# EAGLE design shield (EAGLE 8.0.0)
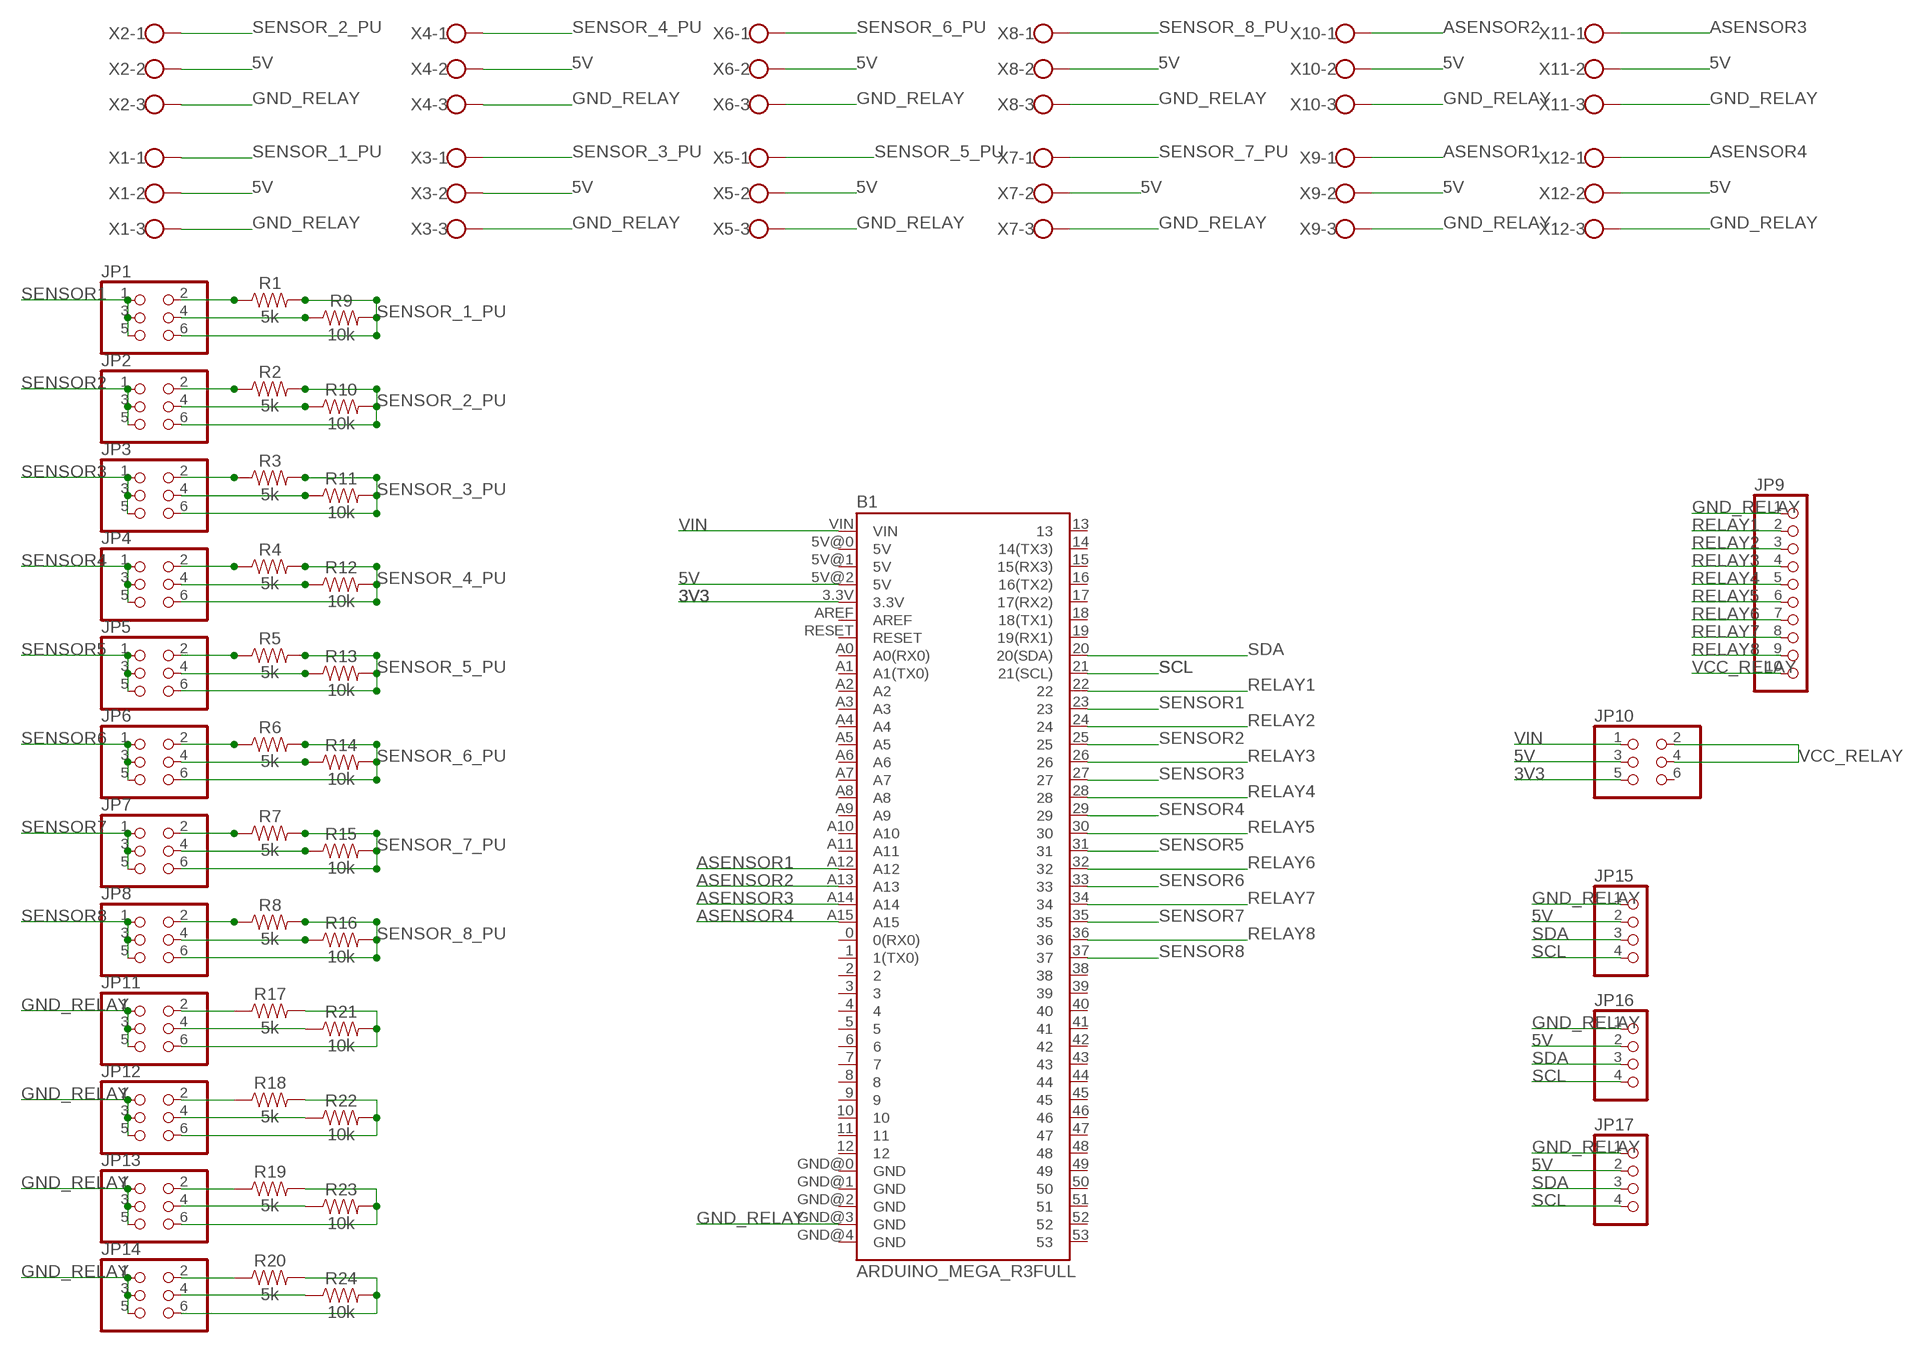
[diagram p0: schematic, sheet 1]

## Parts
B1  ARDUINO_MEGA_R3FULL  [ARDUINO_MEGA]
JP1  PINHD-2X3  [2X03]
JP2  PINHD-2X3  [2X03]
JP3  PINHD-2X3  [2X03]
JP4  PINHD-2X3  [2X03]
JP5  PINHD-2X3  [2X03]
JP6  PINHD-2X3  [2X03]
JP7  PINHD-2X3  [2X03]
JP8  PINHD-2X3  [2X03]
JP9  PINHD-1X10  [1X10]
JP10  PINHD-2X3  [2X03]
JP11  PINHD-2X3  [2X03]
JP12  PINHD-2X3  [2X03]
JP13  PINHD-2X3  [2X03]
JP14  PINHD-2X3  [2X03]
JP15  PINHD-1X4  [1X04]
JP16  PINHD-1X4  [1X04]
JP17  PINHD-1X4  [1X04]
R1  5k  10KOHM-HORIZ-1/4W-1%  [AXIAL-0.3]
R2  5k  10KOHM-HORIZ-1/4W-1%  [AXIAL-0.3]
R3  5k  10KOHM-HORIZ-1/4W-1%  [AXIAL-0.3]
R4  5k  10KOHM-HORIZ-1/4W-1%  [AXIAL-0.3]
R5  5k  10KOHM-HORIZ-1/4W-1%  [AXIAL-0.3]
R6  5k  10KOHM-HORIZ-1/4W-1%  [AXIAL-0.3]
R7  5k  10KOHM-HORIZ-1/4W-1%  [AXIAL-0.3]
R8  5k  10KOHM-HORIZ-1/4W-1%  [AXIAL-0.3]
R9  10k  10KOHM-HORIZ-1/4W-1%  [AXIAL-0.3]
R10  10k  10KOHM-HORIZ-1/4W-1%  [AXIAL-0.3]
R11  10k  10KOHM-HORIZ-1/4W-1%  [AXIAL-0.3]
R12  10k  10KOHM-HORIZ-1/4W-1%  [AXIAL-0.3]
R13  10k  10KOHM-HORIZ-1/4W-1%  [AXIAL-0.3]
R14  10k  10KOHM-HORIZ-1/4W-1%  [AXIAL-0.3]
R15  10k  10KOHM-HORIZ-1/4W-1%  [AXIAL-0.3]
R16  10k  10KOHM-HORIZ-1/4W-1%  [AXIAL-0.3]
R17  5k  10KOHM-HORIZ-1/4W-1%  [AXIAL-0.3]
R18  5k  10KOHM-HORIZ-1/4W-1%  [AXIAL-0.3]
R19  5k  10KOHM-HORIZ-1/4W-1%  [AXIAL-0.3]
R20  5k  10KOHM-HORIZ-1/4W-1%  [AXIAL-0.3]
R21  10k  10KOHM-HORIZ-1/4W-1%  [AXIAL-0.3]
R22  10k  10KOHM-HORIZ-1/4W-1%  [AXIAL-0.3]
R23  10k  10KOHM-HORIZ-1/4W-1%  [AXIAL-0.3]
R24  10k  10KOHM-HORIZ-1/4W-1%  [AXIAL-0.3]
X1  W237-103  [W237-103]
X2  W237-103  [W237-103]
X3  W237-103  [W237-103]
X4  W237-103  [W237-103]
X5  W237-103  [W237-103]
X6  W237-103  [W237-103]
X7  W237-103  [W237-103]
X8  W237-103  [W237-103]
X9  W237-103  [W237-103]
X10  W237-103  [W237-103]
X11  W237-103  [W237-103]
X12  W237-103  [W237-103]

## Nets
3V3: B1.3.3V JP10.5
5V: B1.5V@2(5V) JP10.3 JP15.2 JP16.2 JP17.2 X1.2 X2.2 X3.2 X4.2 X5.2 X6.2 X7.2 X8.2 X9.2 X10.2 X11.2 X12.2
ASENSOR1: B1.A12 X9.1
ASENSOR2: B1.A13 X10.1
ASENSOR3: B1.A14 X11.1
ASENSOR4: B1.A15 X12.1
GND_RELAY: B1.GND@3(GND) JP9.1 JP11.1 JP11.3 JP11.5 JP12.1 JP12.3 JP12.5 JP13.1 JP13.3 JP13.5 JP14.1 JP14.3 JP14.5 JP15.1 JP16.1 JP17.1 X1.3 X2.3 X3.3 X4.3 X5.3 X6.3 X7.3 X8.3 X9.3 X10.3 X11.3 X12.3
N$1: JP2.4 R10.P$1
N$4: JP1.4 R9.P$1
N$7: JP3.4 R11.P$1
N$9: JP4.4 R12.P$1
N$10: JP14.2 R20.P$1
N$11: JP5.4 R13.P$1
N$12: JP14.6 R20.P$2 R24.P$2
N$13: JP6.4 R14.P$1
N$14: JP14.4 R24.P$1
N$15: JP7.4 R15.P$1
N$16: JP13.2 R19.P$1
N$17: JP8.4 R16.P$1
N$18: JP13.6 R19.P$2 R23.P$2
N$19: JP13.4 R23.P$1
N$20: JP12.2 R18.P$1
N$21: JP1.2 R1.P$1
N$22: JP2.2 R2.P$1
N$23: JP3.2 R3.P$1
N$24: JP4.2 R4.P$1
N$25: JP5.2 R5.P$1
N$26: JP6.2 R6.P$1
N$27: JP7.2 R7.P$1
N$28: JP8.2 R8.P$1
N$29: JP12.6 R18.P$2 R22.P$2
N$30: JP12.4 R22.P$1
N$31: JP11.2 R17.P$1
N$32: JP11.6 R17.P$2 R21.P$2
N$33: JP11.4 R21.P$1
RELAY1: B1.22 JP9.2
RELAY2: B1.24 JP9.3
RELAY3: B1.26 JP9.4
RELAY4: B1.28 JP9.5
RELAY5: B1.30 JP9.6
RELAY6: B1.32 JP9.7
RELAY7: B1.34 JP9.8
RELAY8: B1.36 JP9.9
SCL: B1.21(21(SCL)) JP15.4 JP16.4 JP17.4
SDA: B1.20(20(SDA)) JP15.3 JP16.3 JP17.3
SENSOR1: B1.23 JP1.1 JP1.3 JP1.5
SENSOR2: B1.25 JP2.1 JP2.3 JP2.5
SENSOR3: B1.27 JP3.1 JP3.3 JP3.5
SENSOR4: B1.29 JP4.1 JP4.3 JP4.5
SENSOR5: B1.31 JP5.1 JP5.3 JP5.5
SENSOR6: B1.33 JP6.1 JP6.3 JP6.5
SENSOR7: B1.35 JP7.1 JP7.3 JP7.5
SENSOR8: B1.37 JP8.1 JP8.3 JP8.5
SENSOR_1_PU: JP1.6 R1.P$2 R9.P$2 X1.1
SENSOR_2_PU: JP2.6 R2.P$2 R10.P$2 X2.1
SENSOR_3_PU: JP3.6 R3.P$2 R11.P$2 X3.1
SENSOR_4_PU: JP4.6 R4.P$2 R12.P$2 X4.1
SENSOR_5_PU: JP5.6 R5.P$2 R13.P$2 X5.1
SENSOR_6_PU: JP6.6 R6.P$2 R14.P$2 X6.1
SENSOR_7_PU: JP7.6 R7.P$2 R15.P$2 X7.1
SENSOR_8_PU: JP8.6 R8.P$2 R16.P$2 X8.1
VCC_RELAY: JP9.10 JP10.2 JP10.4
VIN: B1.VIN JP10.1
Unconnected: B1.0(0(RX0)) B1.1(1(TX0)) B1.2 B1.3 B1.4 B1.5 B1.5V@0(5V) B1.5V@1(5V) B1.6 B1.7 B1.8 B1.9 B1.10 B1.11 B1.12 B1.13 B1.14(14(TX3)) B1.15(15(RX3)) B1.16(16(TX2)) B1.17(17(RX2)) B1.18(18(TX1)) B1.19(19(RX1)) B1.38 B1.39 B1.40 B1.41 B1.42 B1.43 B1.44 B1.45 B1.46 B1.47 B1.48 B1.49 B1.50 B1.51 B1.52 B1.53 B1.A0(A0(RX0)) B1.A1(A1(TX0)) B1.A2 B1.A3 B1.A4 B1.A5 B1.A6 B1.A7 B1.A8 B1.A9 B1.A10 B1.A11 B1.AREF B1.GND@0(GND) B1.GND@1(GND) B1.GND@2(GND) B1.GND@4(GND) B1.RESET JP10.6

## Library data of the parts
B1 = SparkFun-Boards:ARDUINO_MEGA_R3: Arduino Mega R3 ATmega2560 R3 compatible footprint. SparkFun Products: Arduino Mega 2560 R3 <https://www.sparkfun.com/products/11061>
JP1-JP8 JP10-JP14 = pinhead:PINHD-2X3: PIN HEADER
JP9 = pinhead:PINHD-1X10: PIN HEADER
JP15-JP17 = pinhead:PINHD-1X4: PIN HEADER
R1-R8 R17-R20 = SparkFun-Resistors:10KOHM: 10kΩ resistor A resistor is a passive two-terminal electrical component that implements electrical resistance as a circuit element. Resistors act to reduce current flow, and, at the same time, act to lower voltage levels within circuits. - Wikipedia; PROD_ID: RES-12183; VALUE: 10k
R9-R16 R21-R24 = SparkFun-Resistors:10KOHM: 10kΩ resistor A resistor is a passive two-terminal electrical component that implements electrical resistance as a circuit element. Resistors act to reduce current flow, and, at the same time, act to lower voltage levels within circuits. - Wikipedia; PROD_ID: RES-12183
X1-X12 = con-wago-500:W237-103: WAGO SCREW CLAMP; MPN: 237-103; OC_FARNELL: unknown; OC_NEWARK: 18M7116

## Board
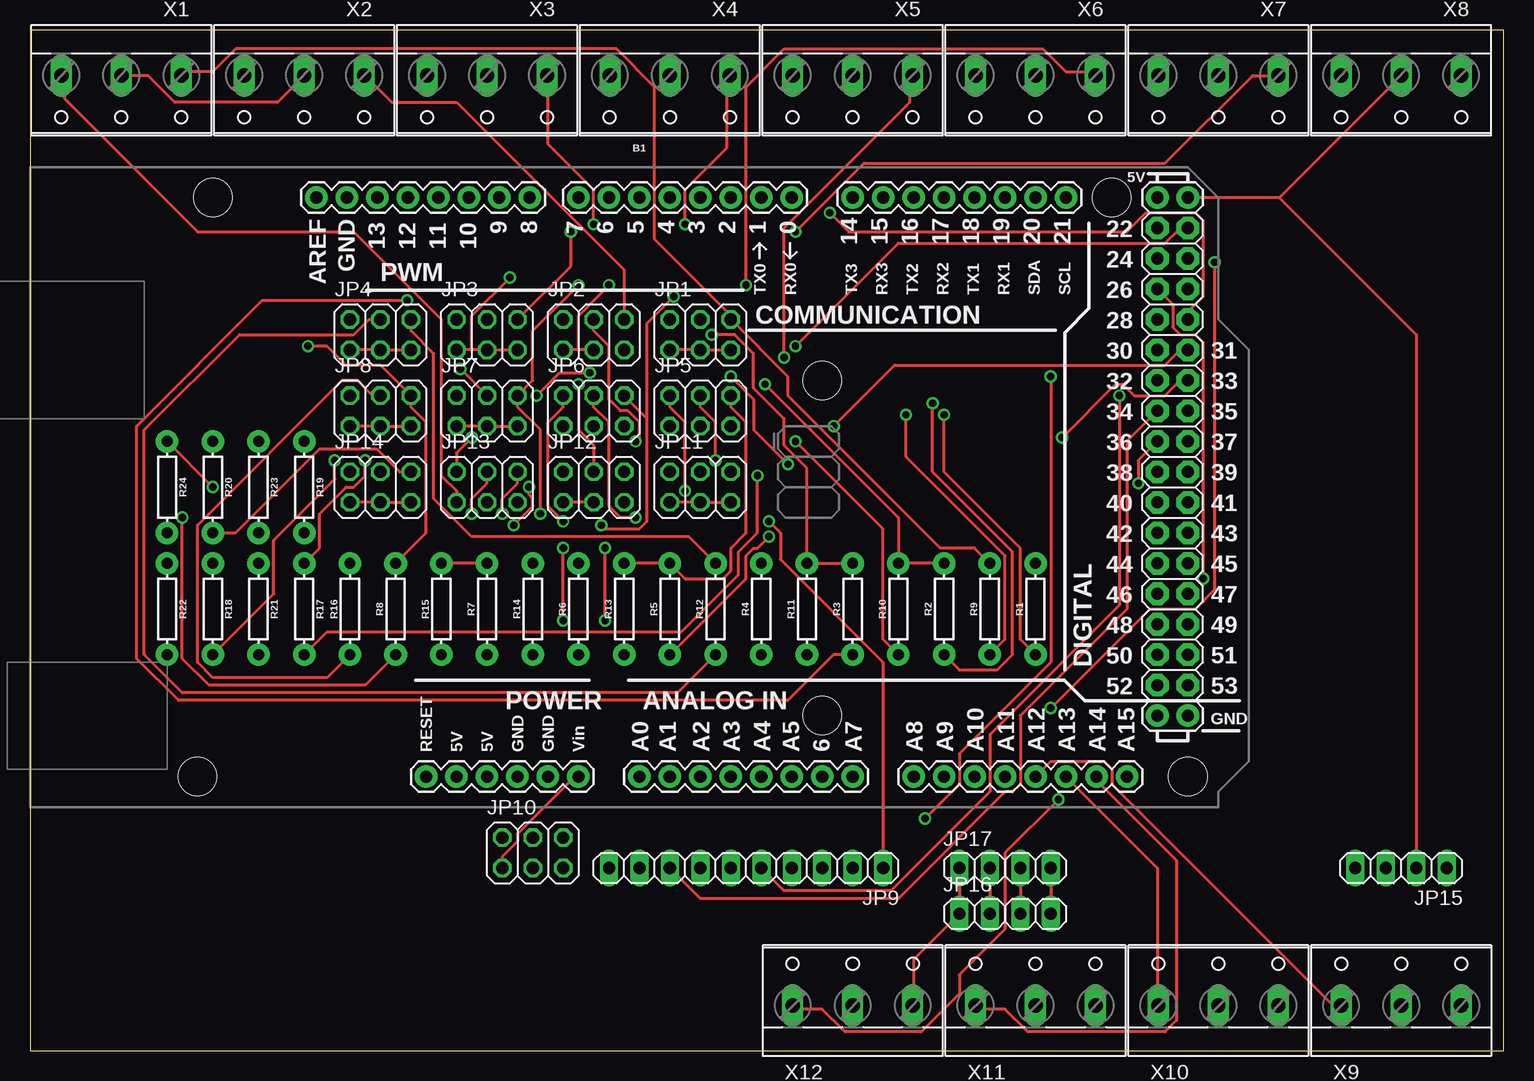
[diagram p1: board, top side]
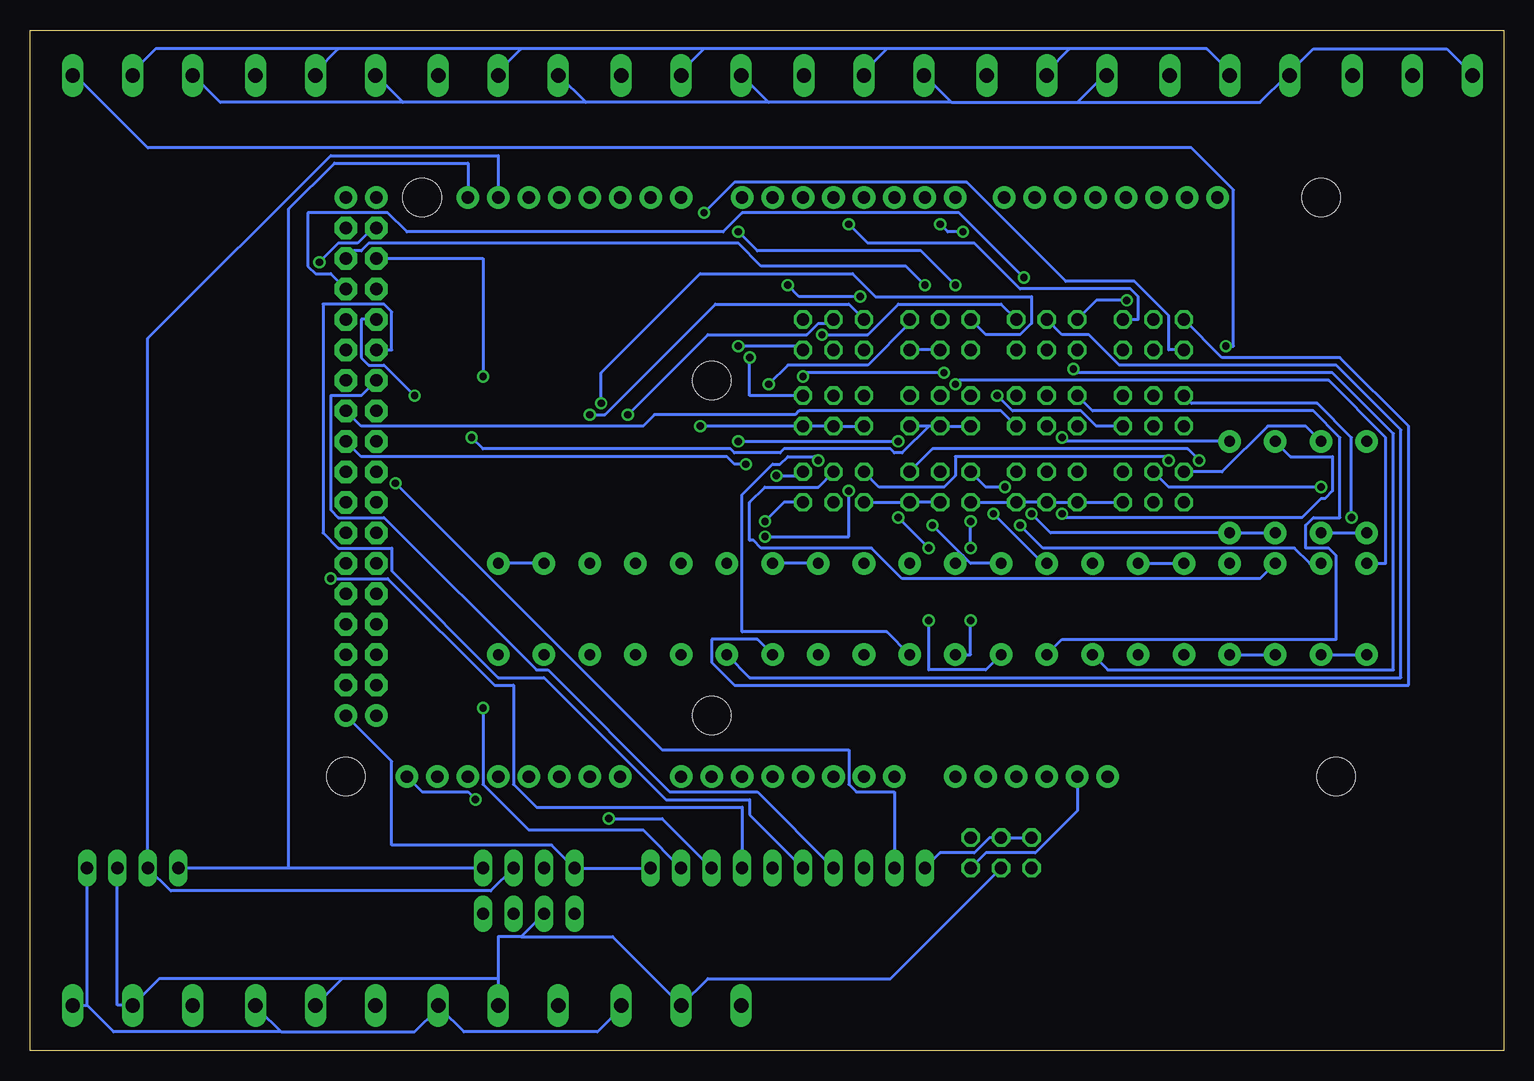
[diagram p2: board, bottom side, seen from below]

Size 122.86 x 85.08 mm. Coordinates in mm from the lower left corner, seen from the top.
Outline: 0,0 122.86,0 122.86,85.08 0,85.08 0,0
Copper layers (1*16): Top 0.035mm / dielectric 1.5mm / Bottom 0.035mm
Design rules "default": minimum track width 10mil, minimum drill 24mil, track to track 8mil, track to pad 8mil, pad to pad 8mil, via to via 8mil, smd to smd 8mil, copper to edge 40mil, drill to drill 8mil, minimum pad ring 10mil, minimum via ring 8mil, stop-mask expansion 4mil, vias tented up to drill 0mil, thermal gap 10mil

### Footprints (pad centres in the part's own frame; a part is rotated, then mirrored left to right if it is on the bottom)
ARDUINO_MEGA = drill 1.016 pad 1.88: 0 13.97,24.13; 1 11.43,24.13; 2 8.89,24.13; 3 6.35,24.13; 3.3V -13.97,-24.13; 4 3.81,24.13; 5 1.27,24.13; 5V@0 -11.43,-24.13; 5V@1 44.45,24.13; 5V@2 46.99,24.13; 6 -1.27,24.13; 7 -3.81,24.13; 8 -7.874,24.13; 9 -10.414,24.13; 10 -12.954,24.13; 11 -15.494,24.13; 12 -18.034,24.13; 13 -20.574,24.13; 14 19.05,24.13; 15 21.59,24.13; 16 24.13,24.13; 17 26.67,24.13; 18 29.21,24.13; 19 31.75,24.13; 20 34.29,24.13; 21 36.83,24.13; A0 1.27,-24.13; A1 3.81,-24.13; A2 6.35,-24.13; A3 8.89,-24.13; A4 11.43,-24.13; A5 13.97,-24.13; A6 16.51,-24.13; A7 19.05,-24.13; A8 24.13,-24.13; A9 26.67,-24.13; A10 29.21,-24.13; A11 31.75,-24.13; A12 34.29,-24.13; A13 36.83,-24.13; A14 39.37,-24.13; A15 41.91,-24.13; AREF -25.654,24.13; GND@0 -8.89,-24.13; GND@1 -6.35,-24.13; GND@2 44.45,-19.05; GND@3 46.99,-19.05; GND@4 -23.114,24.13; RESET -16.51,-24.13; VIN -3.81,-24.13 | drill 1.016 pad 1.88 octagon: 22 44.45,21.59; 23 46.99,21.59; 24 44.45,19.05; 25 46.99,19.05; 26 44.45,16.51; 27 46.99,16.51; 28 44.45,13.97; 29 46.99,13.97; 30 44.45,11.43; 31 46.99,11.43; 32 44.45,8.89; 33 46.99,8.89; 34 44.45,6.35; 35 46.99,6.35; 36 44.45,3.81; 37 46.99,3.81; 38 44.45,1.27; 39 46.99,1.27; 40 44.45,-1.27; 41 46.99,-1.27; 42 44.45,-3.81; 43 46.99,-3.81; 44 44.45,-6.35; 45 46.99,-6.35; 46 44.45,-8.89; 47 46.99,-8.89; 48 44.45,-11.43; 49 46.99,-11.43; 50 44.45,-13.97; 51 46.99,-13.97; 52 44.45,-16.51; 53 46.99,-16.51 | hole 3.2: -34.29,24.13; -35.56,-24.13; 16.51,8.89; 16.51,-19.05; 40.64,24.13; 46.99,-24.13
2X03 = drill 1.016 octagon: 1 -2.54,-1.27; 2 -2.54,1.27; 3 0,-1.27; 4 0,1.27; 5 2.54,-1.27; 6 2.54,1.27
1X10 = drill 1.016 long: 1 -11.43,0; 2 -8.89,0; 3 -6.35,0; 4 -3.81,0; 5 -1.27,0; 6 1.27,0; 7 3.81,0; 8 6.35,0; 9 8.89,0; 10 11.43,0
1X04 = drill 1.016 long: 1 -3.81,0; 2 -1.27,0; 3 1.27,0; 4 3.81,0
AXIAL-0.3 = drill 0.9 pad 1.88: P$1 -3.81,0; P$2 3.81,0
W237-103 = drill 1.194 long: 1 -5,-1.29; 2 0,-1.29; 3 5,-1.29

### Placement (x,y rotation side)
B1  49.53,46.99 0 top
JP1  55.88,59.69 0 top
JP2  46.99,59.69 0 top
JP3  38.1,59.69 0 top
JP4  29.21,59.69 0 top
JP5  55.88,53.34 0 top
JP6  46.99,53.34 0 top
JP7  38.1,53.34 0 top
JP8  29.21,53.34 0 top
JP9  59.69,15.24 180 top
JP10  41.91,16.51 0 top
JP11  55.88,46.99 0 top
JP12  46.99,46.99 0 top
JP13  38.1,46.99 0 top
JP14  29.21,46.99 0 top
JP15  114.3,15.24 180 top
JP16  81.28,11.43 0 top
JP17  81.28,15.24 0 top
R1  83.82,36.83 90 top
R2  76.2,36.83 90 top
R3  68.58,36.83 90 top
R4  60.96,36.83 90 top
R5  53.34,36.83 90 top
R6  45.72,36.83 90 top
R7  38.1,36.83 90 top
R8  30.48,36.83 90 top
R9  80.01,36.83 90 top
R10  72.39,36.83 90 top
R11  64.77,36.83 90 top
R12  57.15,36.83 90 top
R13  49.53,36.83 90 top
R14  41.91,36.83 90 top
R15  34.29,36.83 90 top
R16  26.67,36.83 90 top
R17  22.86,36.83 270 top
R18  15.24,36.83 270 top
R19  22.86,46.99 270 top
R20  15.24,46.99 270 top
R21  19.05,36.83 270 top
R22  11.43,36.83 270 top
R23  19.05,46.99 270 top
R24  11.43,46.99 270 top
X1  7.62,80.01 180 top
X2  22.86,80.01 180 top
X3  38.1,80.01 180 top
X4  53.34,80.01 180 top
X5  68.58,80.01 180 top
X6  83.82,80.01 180 top
X7  99.06,80.01 180 top
X8  114.3,80.01 180 top
X9  114.3,5.08 0 top
X10  99.06,5.08 0 top
X11  83.82,5.08 0 top
X12  68.58,5.08 0 top

### Tracks (layer width: path | path; a pad name or v marks a point on that pad's centre or on a via)
3V3
  Bottom 0.254: JP10.5 43.18,16.51 39.05,16.51 35.56,20 B1.3.3V
5V
  Top 0.254: JP17.2 JP16.2 | X1.2 7.62,81.28 9.84,81.28 12.07,79.06 20.64,79.06 22.86,81.28 X2.2 | 104.14,71.12 B1.5V@2 | 104.14,71.12 114.3,81.28 X8.2 | JP15.2 115.57,59.69 104.14,71.12
  Bottom 0.254: JP10.3 51.12,6.03 66.36,6.03 68.58,3.81 | JP15.2 115.57,3.81 114.3,3.81 | 83.82,6.03 83.82,9.53 81.92,9.53 | 83.82,6.03 X11.2 | JP16.2 81.92,9.53 | 96.84,6.03 99.06,3.81 X10.2 | 83.82,6.03 96.84,6.03 | 114.3,3.81 112.08,6.03 96.84,6.03 | 114.3,3.81 X9.2 | 68.58,3.81 74.3,9.53 81.92,9.53 | 68.58,3.81 X12.2 | 36.2,83.5 38.1,81.6 X3.2 | 36.2,83.5 24.77,83.5 22.86,81.6 X2.2 | 51.44,83.5 53.34,81.6 X4.2 | 36.2,83.5 51.44,83.5 | 66.68,83.5 68.58,81.6 X5.2 | 51.44,83.5 66.68,83.5 | 81.92,83.5 83.82,81.6 X6.2 | 66.68,83.5 81.92,83.5 | 97.16,83.5 99.06,81.6 X7.2 | 81.92,83.5 97.16,83.5 | 97.16,83.5 112.39,83.5 114.3,81.6 X8.2
ASENSOR1
  Top 0.254: B1.A12 85.09,24.13 89.53,24.13 90.17,23.49 90.17,22.23 108.59,3.81 109.22,3.81 X9.1
ASENSOR2
  Top 0.254: B1.A13 93.98,15.24 93.98,3.81 X10.1
ASENSOR3
  Top 0.254: B1.A14 88.9,22.54 95.57,15.88 95.57,2.54 94.61,1.59 83.19,1.59 81.28,3.49 79.06,3.49 X11.1
ASENSOR4  (via drill 0.61)
  Top 0.254: v85.72,20.95 81.28,16.51 81.28,10.16 77.47,6.35 77.47,4.76 74.3,1.59 67.94,1.59 66.04,3.49 63.82,3.49 X12.1
  Bottom 0.254: v85.72,20.95 86.36,21.59 90.17,21.59 B1.A15
GND_RELAY  (via drill 0.61)
  Top 0.254: JP17.1 JP16.1 73.66,7.62 73.66,3.81 X12.3 | JP14.1 JP14.3 JP14.5 | JP12.3 JP12.1 | JP11.1 JP11.3 JP11.5 | JP13.1 35.56,46.67 34.29,47.94 34.29,60.96 26.99,68.26 13.97,68.26 2.86,79.38 2.86,81.28 X1.3 | JP9.1 71.12,32.38 62.55,40.96 62.55,43.18 v61.59,44.13
  Bottom 0.254: 118.11,3.81 JP15.1 | 118.11,3.81 119.06,3.81 X9.3 | 101.92,1.59 90.81,1.59 88.9,3.49 X11.3 88.58,3.49 86.68,1.59 75.56,1.59 73.66,3.49 X12.3 | 101.92,1.59 103.82,3.49 X10.3 | 118.11,3.81 115.89,1.59 101.92,1.59 | JP9.1 JP17.1 79.38,17.14 92.71,17.14 92.71,24.13 B1.GND@3 | JP14.5 JP13.1 JP13.3 JP13.5 JP12.1 | JP12.3 JP12.5 JP11.1 | X1.3 2.86,81.6 4.76,83.5 15.88,83.5 17.78,81.6 X2.3 18.1,81.28 20.32,79.06 35.56,79.06 | 35.56,79.06 33.34,81.28 X3.3 | 46.04,79.06 35.56,79.06 | 46.04,79.06 48.26,81.28 X4.3 | 61.28,79.06 63.5,81.28 X5.3 | 46.04,79.06 61.28,79.06 | 76.52,79.06 78.74,81.28 X6.3 | 61.28,79.06 76.52,79.06 | 91.76,79.06 93.98,81.28 X7.3 | 76.52,79.06 91.76,79.06 | 91.76,79.06 107,79.06 109.22,81.28 X8.3 | v61.59,44.13 60.01,45.72 JP11.5
N$1  (via drill 0.61)
  Top 0.254: JP2.4 46.99,60.01 48.26,58.74 48.26,54.29 49.21,53.34 49.85,53.34 50.8,52.39 50.8,51.12 v50.48,50.8 | v63.82,50.8 71.12,43.5 71.12,34.29 R10.P$1
  Bottom 0.254: v63.82,50.8 v50.48,50.8
N$4  (via drill 0.61)
  Top 0.254: v73.03,53.02 73.03,49.53 81.28,41.27 81.28,34.29 R9.P$1
  Bottom 0.254: JP1.4 56.2,60.64 57.15,60.64 58.1,59.69 66.36,59.69 v73.03,53.02
N$7
  Bottom 0.254: JP3.4 36.83,59.69 34.61,59.69 32.07,57.15 13.97,57.15 8.57,51.75 8.57,31.12 62.87,31.12 R11.P$1
N$9
  Top 0.254: JP4.4 28.26,60.96 26.99,59.69 17.46,59.69 9.53,51.75 9.53,33.02 12.7,29.84 53.98,29.84 R12.P$1
N$10
  Bottom 0.254: JP14.2 23.5,48.26 19.69,52.07 16.51,52.07 R20.P$1
N$11  (via drill 0.61)
  Top 0.254: JP5.4 55.88,53.66 57.15,52.39 v57.15,49.21
  Bottom 0.254: v57.15,49.21 57.47,49.53 59.69,49.53 60.33,48.89 60.96,48.89 63.5,46.35 63.5,34.92 51.44,34.92 R13.P$1
N$12
  Top 0.254: JP14.6 30.8,48.26 28.89,50.16 24.13,50.16 17.14,43.18 R20.P$2
  Bottom 0.254: R20.P$2 R24.P$2
N$13  (via drill 0.61)
  Top 0.254: JP6.4 46.99,53.66 48.26,52.39 48.26,45.4 49.21,44.45 v50.48,44.45 | v47.94,35.88 v47.94,41.91
  Bottom 0.254: v47.94,41.91 v50.48,44.45 | v47.94,35.88 47.94,31.75 43.18,31.75 R14.P$1
N$14  (via drill 0.61)
  Top 0.254: R24.P$1 v15.24,46.99
  Bottom 0.254: JP14.4 27.94,46.99 v15.24,46.99
N$15  (via drill 0.61)
  Top 0.254: v35.88,56.83 JP7.4
  Bottom 0.254: v35.88,56.83 35.56,56.52 14.29,56.52 9.21,51.43 9.21,31.75 33.02,31.75 R15.P$1
N$16  (via drill 0.61)
  Top 0.254: JP13.2 35.56,49.85 v36.83,51.12
  Bottom 0.254: v36.83,51.12 36.51,50.8 R19.P$1
N$17
  Top 0.254: JP8.4 28.58,54.61 27.3,55.88 26.04,55.88 13.97,43.81 13.97,32.38 15.24,31.12 24.77,31.12 R16.P$1
N$18  (via drill 0.61)
  Top 0.254: JP13.6 40.64,47.31 39.37,46.04 v39.37,44.77
  Bottom 0.254: v39.37,44.77 37.78,43.18 R19.P$2 R23.P$2
N$19  (via drill 0.61)
  Top 0.254: JP13.4 38.1,47.31 36.83,46.04 v36.83,44.77
  Bottom 0.254: v36.83,44.77 36.51,44.45 16.83,44.45 15.24,46.04 14.92,46.04 14.29,46.67 14.29,49.53 17.78,49.53 R23.P$1
N$20  (via drill 0.61)
  Top 0.254: v41.59,46.99 41.59,46.35 41.91,46.04 41.91,45.4 v40.32,43.81
  Bottom 0.254: JP12.2 43.18,46.99 v41.59,46.99 | v40.32,43.81 38.42,41.91 17.46,41.91 16.19,40.64 R18.P$1
N$21  (via drill 0.61)
  Top 0.254: v76.2,53.02 76.2,48.26 82.55,41.91 82.55,34.29 R1.P$1
  Bottom 0.254: JP1.2 54.61,62.23 65.72,62.23 74.93,53.02 v76.2,53.02
N$22  (via drill 0.61)
  Top 0.254: v75.25,53.98 75.25,48.26 81.92,41.59 81.92,33.02 80.65,31.75 77.47,31.75 R2.P$1
  Bottom 0.254: JP2.2 43.18,59.69 40.32,59.69 39.37,60.64 39.37,62.86 52.39,62.86 54.29,64.77 66.99,64.77 75.25,56.52 v75.25,53.98
N$23  (via drill 0.61)
  Top 0.254: v31.43,62.55 19.37,62.55 8.89,52.07 8.89,32.7 12.38,29.21 63.18,29.21 66.99,33.02 R3.P$1
  Bottom 0.254: JP3.2 33.97,62.55 v31.43,62.55
N$24
  Bottom 0.254: JP4.2 23.5,57.78 13.65,57.78 7.94,52.07 7.94,30.48 64.13,30.48 66.04,32.38 66.04,34.29 62.23,34.29 R4.P$1
N$25  (via drill 0.61)
  Top 0.254: JP5.2 53.34,53.66 54.61,52.39 v54.61,46.67 | v61.59,42.86 60.64,41.91 60.33,41.91 59.69,41.27 59.69,39.37 R5.P$1
  Bottom 0.254: v54.61,46.67 54.61,42.86 v61.59,42.86
N$26  (via drill 0.61)
  Top 0.254: JP6.2 44.45,53.66 43.18,52.39 43.18,45.4 v44.45,44.13 | v44.45,35.88 v44.45,41.91
  Bottom 0.254: v44.45,41.91 v44.45,44.13 | v44.45,35.88 44.45,33.02 R6.P$1
N$27
  Bottom 0.254: JP7.2 34.29,53.34 15.88,53.34 13.65,51.12 13.65,44.45 15.88,44.45 16.51,43.81 16.51,41.91 14.61,41.91 13.97,41.27 13.97,34.29 36.83,34.29 R7.P$1
N$28  (via drill 0.61)
  Top 0.254: v12.7,44.45 12.7,32.7 14.92,30.48 27.94,30.48 R8.P$1
  Bottom 0.254: JP8.2 26.04,53.98 15.56,53.98 12.7,51.12 v12.7,44.45
N$29  (via drill 0.61)
  Top 0.254: v25.4,49.21 25.4,47.62 20.32,42.55 20.32,38.1 R18.P$2
  Bottom 0.254: JP12.6 47.62,50.16 26.35,50.16 v25.4,49.21 | R18.P$2 R22.P$2
N$30  (via drill 0.61)
  Top 0.254: JP12.4 46.99,50.48 45.72,51.75 v45.72,55.56
  Bottom 0.254: v45.72,55.56 45.4,55.88 14.61,55.88 9.84,51.12 9.84,40.64 R22.P$1
N$31  (via drill 0.61)
  Top 0.254: v27.94,49.21 27.94,47.94 26.99,46.99 26.35,46.99 24.13,44.77 24.13,41.91 R17.P$1
  Bottom 0.254: JP11.2 52.07,46.99 46.67,46.99 45.72,47.94 45.72,49.53 28.26,49.53 v27.94,49.21
N$32  (via drill 0.61)
  Top 0.254: v60.64,47.94 60.64,43.18 59.05,41.59 59.05,39.69 54.29,34.92 24.77,34.92 R17.P$2
  Bottom 0.254: JP11.6 58.74,47.94 v60.64,47.94 | R17.P$2 R21.P$2
N$33
  Bottom 0.254: JP11.4 57.15,46.99 61.59,46.99 62.87,45.72 62.87,42.55 62.55,42.55 61.91,41.91 52.7,41.91 50.16,39.37 20.32,39.37 R21.P$1
RELAY1  (via drill 0.61)
  Top 0.254: v85.09,28.58 93.34,36.83 97.16,36.83 98.74,38.42 v98.74,65.72
  Bottom 0.254: JP9.2 71.75,18.41 81.28,18.41 85.09,22.23 v85.09,28.58 | v98.74,65.72 97.16,67.31 95.57,67.31 94.3,68.58 B1.22
RELAY2  (via drill 0.61)
  Top 0.254: v74.61,19.37 77.47,22.23 77.47,24.77 85.09,32.38 v85.09,56.2
  Bottom 0.254: JP9.3 70.17,19.37 v74.61,19.37 | v85.09,56.2 85.09,66.04 B1.24
RELAY3  (via drill 0.61)
  Top 0.254: v97.79,39.37 97.79,59.05 97.16,59.69 95.89,59.69 95.25,60.32 95.25,62.23 B1.26
  Bottom 0.254: JP9.4 63.5,20.32 80.65,20.32 82.55,22.23 82.55,30.48 84.14,30.48 93.03,39.37 v97.79,39.37
RELAY4  (via drill 0.61)
  Top 0.254: JP9.5 62.87,13.34 71.75,13.34 80.01,21.59 80.01,26.35 90.81,37.15 v90.81,54.61
  Bottom 0.254: v90.81,54.61 93.34,57.15 94.61,57.15 95.25,57.78 95.25,60.96 B1.28
RELAY5
  Bottom 0.254: JP9.6 62.87,19.69 62.87,20.95 69.85,20.95 80.01,31.12 83.82,31.12 92.71,40 92.71,41.91 97.16,41.91 98.42,43.18 98.42,62.23 93.34,62.23 92.71,61.59 92.71,58.42 B1.30
RELAY6
  Bottom 0.254: JP9.7 62.23,21.59 69.53,21.59 79.69,31.75 80.65,31.75 93.34,44.45 97.16,44.45 97.79,45.09 97.79,54.61 95.25,54.61 B1.32
RELAY7
  Top 0.254: JP9.8 55.88,12.7 72.39,12.7 81.28,21.59 81.92,21.59 82.55,22.23 82.55,27.94 91.44,36.83 91.44,50.8 B1.34
RELAY8  (via drill 0.61)
  Top 0.254: v92.39,47.31 92.39,49.21 B1.36
  Bottom 0.254: JP9.9 50.8,21.59 53.98,21.59 54.61,22.23 54.61,25.08 70.17,25.08 v92.39,47.31
SCL
  Top 0.254: JP17.4 JP16.4
  Bottom 0.254: JP17.4 101.28,15.24 | 101.28,15.24 JP15.4 | B1.21 86.36,73.98 97.47,73.98 101.28,70.17 101.28,15.24
SDA
  Top 0.254: JP17.3 JP16.3
  Bottom 0.254: JP17.3 84.45,13.34 111.12,13.34 JP15.3 113.03,59.37 97.79,74.61 83.82,74.61 B1.20
SENSOR1  (via drill 0.61)
  Top 0.254: JP1.1 JP1.3 JP1.5 | B1.23 95.89,68.58 94.61,67.31 72.39,67.31 v63.82,58.74
  Bottom 0.254: v63.82,58.74 58.74,58.74 JP1.5
SENSOR2  (via drill 0.61)
  Top 0.254: JP2.3 45.72,58.42 | 45.72,58.42 JP2.1 | v48.26,63.82 45.72,61.28 45.72,58.42
  Bottom 0.254: JP2.3 JP2.5 | B1.25 95.89,66.67 95.25,66.67 94.61,67.31 63.82,67.31 61.91,65.41 49.85,65.41 v48.26,63.82
SENSOR3  (via drill 0.61)
  Top 0.254: 36.83,58.42 JP3.3 JP3.5 | 36.83,58.42 JP3.1 | v40.01,64.45 36.83,61.28 36.83,58.42
  Bottom 0.254: B1.27 97.79,64.77 99.06,64.77 99.7,65.41 99.7,69.85 93.03,69.85 91.44,68.26 65.09,68.26 63.5,69.85 45.4,69.85 v40.01,64.45
SENSOR4  (via drill 0.61)
  Top 0.254: JP4.1 JP4.3 JP4.5 | B1.29 96.52,61.59 97.79,62.86 97.79,69.22 97.16,69.85 93.03,69.85 91.44,68.26 68.26,68.26 v66.68,69.85
  Bottom 0.254: v66.68,69.85 64.13,72.39 44.77,72.39 36.51,64.14 30.8,64.14 27.94,61.28 27.94,58.42 JP4.1
SENSOR5  (via drill 0.61)
  Top 0.254: B1.31 95.89,58.42 94.61,57.15 72.07,57.15 v66.99,52.07
  Bottom 0.254: JP5.1 JP5.3 JP5.5 v66.99,52.07
SENSOR6  (via drill 0.61)
  Top 0.254: B1.33 95.89,55.88 94.61,54.61 92.08,54.61 91.12,55.56 90.49,55.56 v86.04,51.12
  Bottom 0.254: JP6.1 JP6.3 47.94,52.07 | 47.94,52.07 JP6.5 | v86.04,51.12 85.09,50.16 64.45,50.16 64.13,49.85 60.33,49.85 60.01,50.16 51.12,50.16 50.8,49.85 50.16,49.85 47.94,52.07
SENSOR7
  Top 0.254: JP7.1 JP7.3 JP7.5
  Bottom 0.254: B1.35 95.25,52.07 71.75,52.07 70.8,53.02 59.05,53.02 58.74,53.34 41.91,53.34 JP7.5
SENSOR8  (via drill 0.61)
  Top 0.254: JP8.1 JP8.3 JP8.5 | v63.18,48.89 60.33,51.75 60.33,54.29 v58.42,56.2 | v46.67,56.52 44.13,56.52 v42.23,54.61
  Bottom 0.254: B1.37 95.25,49.53 64.77,49.53 64.13,48.89 v63.18,48.89 | v58.42,56.2 58.1,56.52 v46.67,56.52 | v42.23,54.61 40.96,53.34 35.24,53.34 33.97,52.07 JP8.5
SENSOR_1_PU
  Top 0.254: R9.P$2 78.74,41.91 75.88,41.91 63.18,54.61 63.18,56.2 JP1.6 58.42,61.28 52.07,67.63 52.07,80.33 48.89,83.5 17.14,83.5 15.24,81.6 12.7,81.6 X1.1
  Bottom 0.254: R9.P$2 R1.P$2
SENSOR_2_PU  (via drill 0.61)
  Top 0.254: R2.P$2 R10.P$2 72.39,44.45 v61.28,55.56 | JP2.6 49.53,65.09 35.56,79.06 30.16,79.06 27.94,81.28 X2.1
  Bottom 0.254: v61.28,55.56 59.69,57.15 53.02,57.15 49.53,60.64 JP2.6
SENSOR_3_PU  (via drill 0.61)
  Top 0.254: v56.83,59.69 58.74,59.69 60.33,58.1 60.33,55.24 62.87,52.7 62.87,50.48 64.77,48.58 R11.P$2 R3.P$2 | v46.99,68.9 46.99,71.75 43.18,75.56 43.18,81.28 X3.1 | v45.09,68.26 45.09,65.41 JP3.6
  Bottom 0.254: JP3.6 41.91,62.23 50.48,62.23 53.02,59.69 v56.83,59.69 | v46.99,68.9 46.36,68.26 v45.09,68.26
SENSOR_4_PU  (via drill 0.61)
  Top 0.254: JP4.6 31.75,60.01 33.66,58.1 33.66,46.04 36.83,42.86 54.93,42.86 R12.P$2 | v54.61,68.9 54.61,71.75 58.1,75.25 58.1,81.28 X4.1
  Bottom 0.254: v54.61,68.9 53.02,67.31 44.13,67.31 40.32,63.5 31.12,63.5 30.48,62.86 30.48,60.96 JP4.6 | R12.P$2 R4.P$2
SENSOR_5_PU  (via drill 0.61)
  Top 0.254: JP5.6 58.42,53.66 59.69,52.39 59.69,43.18 58.42,41.91 58.42,40 57.79,39.37 54.61,39.37 R5.P$2 R13.P$2 | v62.87,57.78 62.87,68.58 73.34,79.06 73.34,81.28 X5.1
  Bottom 0.254: v62.87,57.78 62.87,54.61 JP5.6
SENSOR_6_PU  (via drill 0.61)
  Top 0.254: 51.44,52.7 JP6.6 | 51.44,52.7 51.44,44.13 50.8,43.5 47.94,43.5 v47.62,43.81 | v59.69,63.82 59.69,80.33 62.87,83.5 84.45,83.5 86.36,81.6 88.58,81.6 X6.1 | v53.66,62.86 51.44,60.64 51.44,52.7
  Bottom 0.254: 45.09,41.27 44.45,40.64 R14.P$2 | 45.09,41.27 v47.62,43.81 | v59.69,63.82 58.74,62.86 v53.66,62.86 | 45.09,41.27 R6.P$2
SENSOR_7_PU  (via drill 0.61)
  Top 0.254: v42.55,44.77 42.55,51.75 40.64,53.66 JP7.6 41.91,55.88 41.91,60.01 v45.72,63.82 | v63.82,68.26 69.53,73.98 94.61,73.98 101.92,81.28 103.82,81.28 X7.1 | R7.P$2 R15.P$2
  Bottom 0.254: v42.55,44.77 38.42,40.64 R7.P$2 | v63.82,68.26 62.23,66.67 48.58,66.67 v45.72,63.82
SENSOR_8_PU  (via drill 0.61)
  Top 0.254: R8.P$2 33.02,43.18 33.02,52.39 31.75,53.66 JP8.6 29.21,57.15 26.35,57.15 24.77,58.74 v23.18,58.74
  Bottom 0.254: v23.18,58.74 22.54,58.74 22.54,71.75 26.04,75.25 113.03,75.25 119.06,81.28 X8.1 | R8.P$2 R16.P$2
VCC_RELAY
  Bottom 0.254: JP10.2 JP10.4 42.86,17.78 44.13,16.51 46.99,16.51 JP9.10
VIN
  Top 0.254: JP10.1 39.37,16.19 40.64,17.46 40.64,18.1 45.4,22.86 B1.VIN